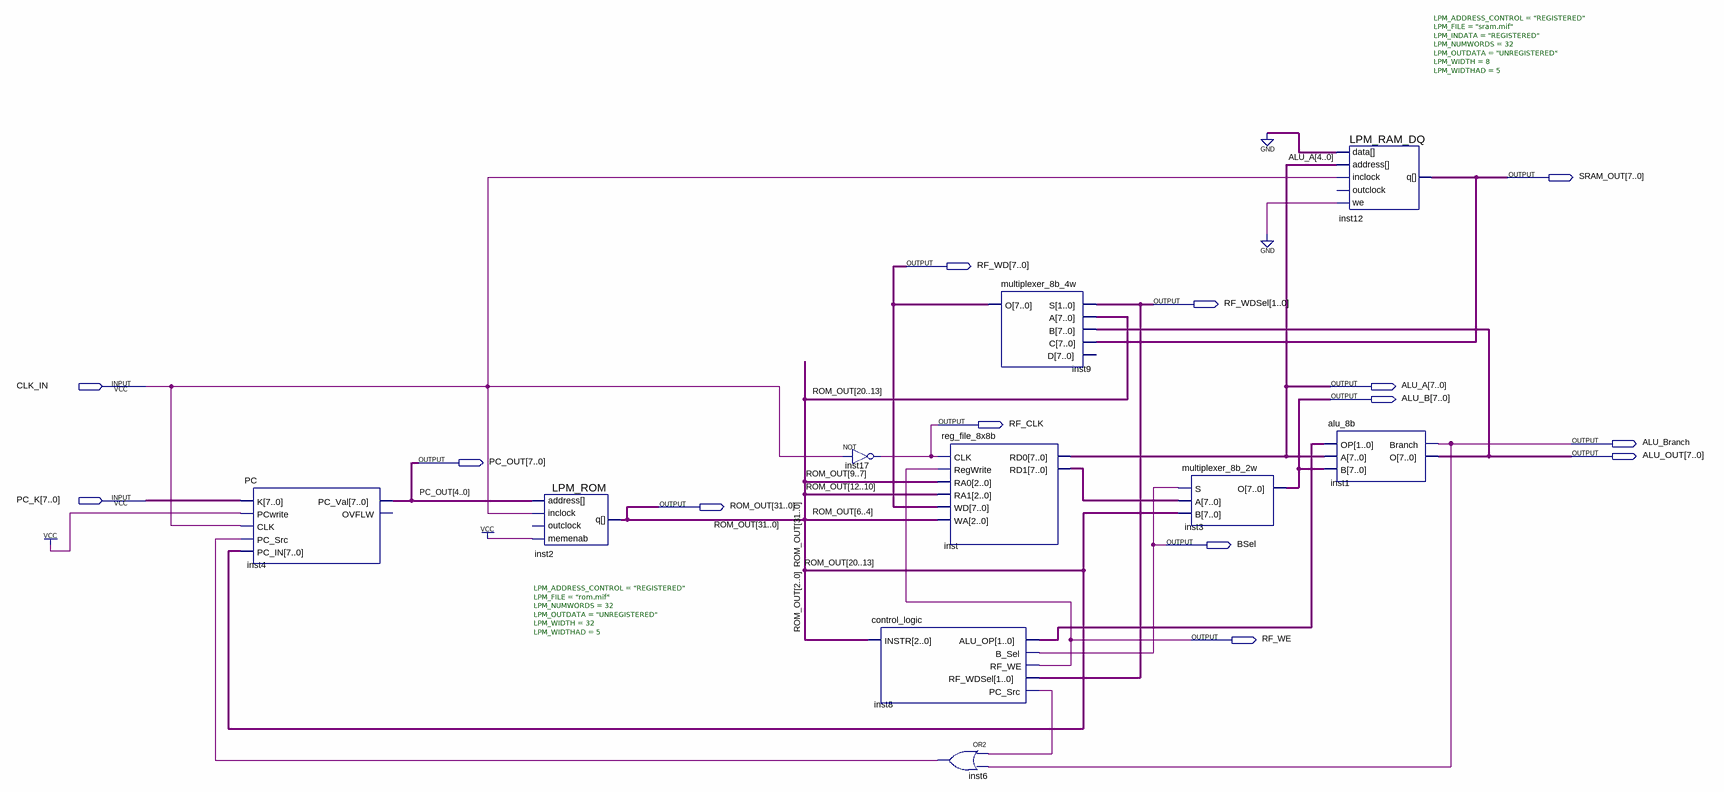
[diagram p0: schematic sheet]
// Quartus schematic cao_final_project.bdf as structural Verilog: 10 symbols, 14 pins
module cao_final_project (
  input  CLK_IN,
  input  [7:0] PC_K,
  output [7:0] SRAM_OUT,
  output [7:0] RF_WD,
  output [1:0] RF_WDSel,
  output [7:0] ALU_A,
  output [7:0] ALU_B,
  output RF_CLK,
  output ALU_Branch,
  output [7:0] ALU_OUT,
  output [7:0] PC_OUT,
  output [31:0] ROM_OUT,
  output BSel,
  output RF_WE
);

  wire inst6_out, inst8_pc_src;
  wire [1:0] inst8_alu_op;
  wire [7:0] inst_rd1;

  PC inst4 (
    .K(PC_K), .PCwrite(1'b1), .CLK(CLK_IN), .PC_Src(inst6_out), .PC_IN(ROM_OUT[20:13]), .PC_Val(PC_OUT));  // open: OVFLW
  LPM_ROM #(.LPM_ADDRESS_CONTROL("REGISTERED"), .LPM_FILE("rom.mif"), .LPM_NUMWORDS(32), .LPM_OUTDATA("UNREGISTERED"), .LPM_WIDTH(32), .LPM_WIDTHAD(5)) inst2 (
    .address(PC_OUT[4:0]), .inclock(CLK_IN), .memenab(1'b1), .q(ROM_OUT));  // open: outclock
  not inst17 (RF_CLK, CLK_IN);
  control_logic inst8 (
    .INSTR(ROM_OUT[2:0]), .ALU_OP(inst8_alu_op), .B_Sel(BSel), .RF_WE(RF_WE), .RF_WDSel(RF_WDSel),
    .PC_Src(inst8_pc_src));
  reg_file_8x8b inst (
    .CLK(RF_CLK), .RegWrite(RF_WE), .RA0(ROM_OUT[9:7]), .RA1(ROM_OUT[12:10]), .WD(RF_WD), .WA(ROM_OUT[6:4]),
    .RD0(ALU_A), .RD1(inst_rd1));
  or inst6 (inst6_out, inst8_pc_src, ALU_Branch);
  multiplexer_8b_4w inst9 (.S(RF_WDSel), .A(ROM_OUT[20:13]), .B(ALU_OUT), .C(SRAM_OUT), .O(RF_WD));  // open: D
  multiplexer_8b_2w inst3 (.S(BSel), .A(inst_rd1), .B(ROM_OUT[20:13]), .O(ALU_B));
  LPM_RAM_DQ #(.LPM_ADDRESS_CONTROL("REGISTERED"), .LPM_FILE("sram.mif"), .LPM_INDATA("REGISTERED"), .LPM_NUMWORDS(32), .LPM_OUTDATA("UNREGISTERED"), .LPM_WIDTH(8), .LPM_WIDTHAD(5)) inst12 (
    .inclock(CLK_IN), .data({8{1'b0}}), .address(ALU_A[4:0]), .we(1'b0), .q(SRAM_OUT));  // open: outclock
  alu_8b inst1 (.OP(inst8_alu_op), .A(ALU_A), .B(ALU_B), .Branch(ALU_Branch), .O(ALU_OUT));
endmodule
